# Altium schematic sheet RGMII ETHERNET.SchDoc: RGMII Ethernet
size 431 x 279 mm; CheckedBy: Lance Bantoto; Engineer: Chealsie Bains; DocumentNumber: 17; Revision: 1; SheetNumber: 17; SheetTotal: 23
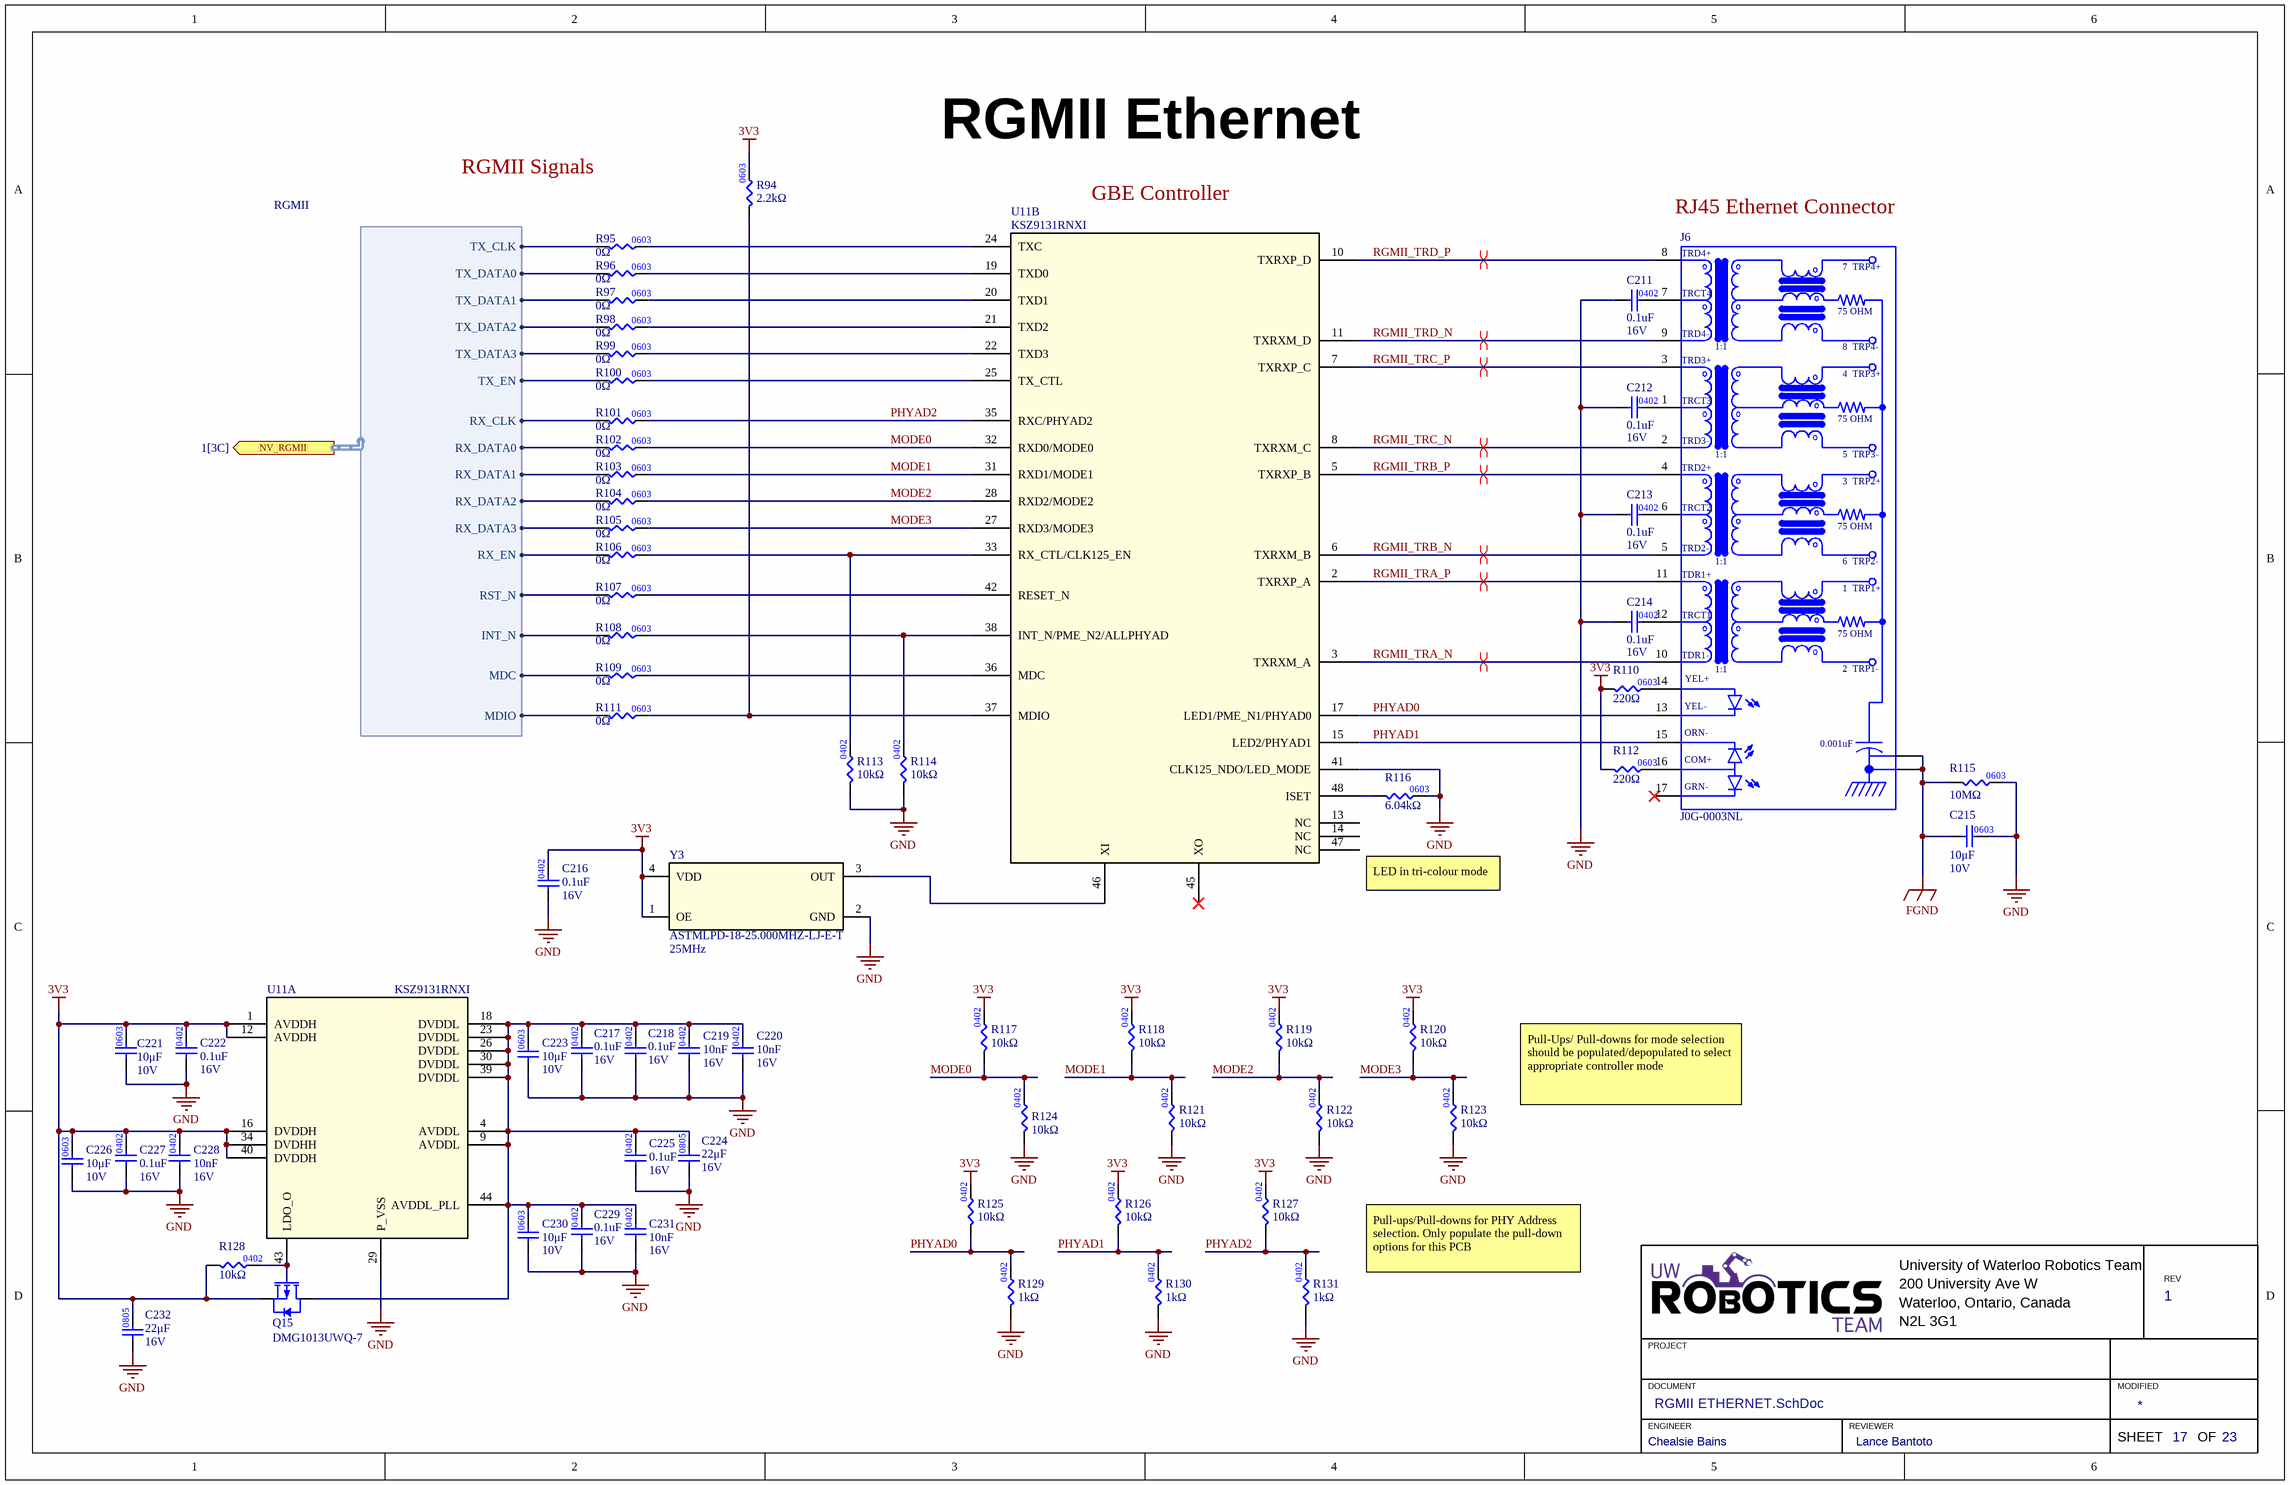
[diagram p0: RGMII ETHERNET.SchDoc]

## Parts
C211  Capacitance: 0.1uF  Rated DC Voltage (URdc): 16V  [CAP0402]  (hidden comment: CAP_0.1uF_16V_X7R_0402)
C212  Capacitance: 0.1uF  Rated DC Voltage (URdc): 16V  [CAP0402]  (hidden comment: CAP_0.1uF_16V_X7R_0402)
C213  Capacitance: 0.1uF  Rated DC Voltage (URdc): 16V  [CAP0402]  (hidden comment: CAP_0.1uF_16V_X7R_0402)
C214  Capacitance: 0.1uF  Rated DC Voltage (URdc): 16V  [CAP0402]  (hidden comment: CAP_0.1uF_16V_X7R_0402)
C215  value 10μF  Voltage Rating: 10V  [CAP0603]  (hidden comment: CAP_10uF_10V_0603)
C216  Capacitance: 0.1uF  Rated DC Voltage (URdc): 16V  [CAP0402]  (hidden comment: CAP_0.1uF_16V_X7R_0402)
C217  Capacitance: 0.1uF  Rated DC Voltage (URdc): 16V  [CAP0402]  (hidden comment: CAP_0.1uF_16V_X7R_0402)
C218  Capacitance: 0.1uF  Rated DC Voltage (URdc): 16V  [CAP0402]  (hidden comment: CAP_0.1uF_16V_X7R_0402)
C219  Capacitance: 10nF  Rated DC Voltage (URdc): 16V  [CAP0402]  (hidden comment: CAP_0.01uF_16V_X7R_0402)
C220  Capacitance: 10nF  Rated DC Voltage (URdc): 16V  [CAP0402]  (hidden comment: CAP_0.01uF_16V_X7R_0402)
C221  value 10μF  Voltage Rating: 10V  [CAP0603]  (hidden comment: CAP_10uF_10V_0603)
C222  Rated DC Voltage (URdc): 16V  Capacitance: 0.1uF  [CAP0402]  (hidden comment: CAP_0.1uF_16V_X7R_0402)
C223  value 10μF  Voltage Rating: 10V  [CAP0603]  (hidden comment: CAP_10uF_10V_0603)
C224  value 22μF  Voltage Rating: 16V  [CAP2012]  (hidden comment: CAP_22uF_16V_0805)
C225  Rated DC Voltage (URdc): 16V  Capacitance: 0.1uF  [CAP0402]  (hidden comment: CAP_0.1uF_16V_X7R_0402)
C226  value 10μF  Voltage Rating: 10V  [CAP0603]  (hidden comment: CAP_10uF_10V_0603)
C227  Rated DC Voltage (URdc): 16V  Capacitance: 0.1uF  [CAP0402]  (hidden comment: CAP_0.1uF_16V_X7R_0402)
C228  Capacitance: 10nF  Rated DC Voltage (URdc): 16V  [CAP0402]  (hidden comment: CAP_0.01uF_16V_X7R_0402)
C229  Capacitance: 0.1uF  Rated DC Voltage (URdc): 16V  [CAP0402]  (hidden comment: CAP_0.1uF_16V_X7R_0402)
C230  value 10μF  Voltage Rating: 10V  [CAP0603]  (hidden comment: CAP_10uF_10V_0603)
C231  Capacitance: 10nF  Rated DC Voltage (URdc): 16V  [CAP0402]  (hidden comment: CAP_0.01uF_16V_X7R_0402)
C232  value 22μF  Voltage Rating: 16V  [CAP2012]  (hidden comment: CAP_22uF_16V_0805)
J6  J0G-0003NL  [PULSE_J0G-0003NL]
Q15  Manufacturer Part Number: DMG1013UWQ-7  (hidden comment: PMOS_20V_820MA SOT323)
R94  value 2.2kΩ  [RES0603]  (hidden comment: RES_2.2kΩ_0603_1%)
R95  value 0Ω  [RES0603]  (hidden comment: RES_0Ω_0603)
R96  value 0Ω  [RES0603]  (hidden comment: RES_0Ω_0603)
R97  value 0Ω  [RES0603]  (hidden comment: RES_0Ω_0603)
R98  value 0Ω  [RES0603]  (hidden comment: RES_0Ω_0603)
R99  value 0Ω  [RES0603]  (hidden comment: RES_0Ω_0603)
R100  value 0Ω  [RES0603]  (hidden comment: RES_0Ω_0603)
R101  value 0Ω  [RES0603]  (hidden comment: RES_0Ω_0603)
R102  value 0Ω  [RES0603]  (hidden comment: RES_0Ω_0603)
R103  value 0Ω  [RES0603]  (hidden comment: RES_0Ω_0603)
R104  value 0Ω  [RES0603]  (hidden comment: RES_0Ω_0603)
R105  value 0Ω  [RES0603]  (hidden comment: RES_0Ω_0603)
R106  value 0Ω  [RES0603]  (hidden comment: RES_0Ω_0603)
R107  value 0Ω  [RES0603]  (hidden comment: RES_0Ω_0603)
R108  value 0Ω  [RES0603]  (hidden comment: RES_0Ω_0603)
R109  value 0Ω  [RES0603]  (hidden comment: RES_0Ω_0603)
R110  value 220Ω  [RES0603]  (hidden comment: RES_220Ω_0603)
R111  value 0Ω  [RES0603]  (hidden comment: RES_0Ω_0603)
R112  value 220Ω  [RES0603]  (hidden comment: RES_220Ω_0603)
R113  Resistance: 10kΩ  [RES0402]  (hidden comment: RES_10kΩ_0402_1%)
R114  Resistance: 10kΩ  [RES0402]  (hidden comment: RES_10kΩ_0402_1%)
R115  value 10MΩ  [RES0603]  (hidden comment: RES_10MΩ_0603)
R116  value 6.04kΩ  [RES0603]  (hidden comment: RES_6.04kΩ_0603_1%)
R117  Resistance: 10kΩ  [RES0402]  (hidden comment: RES_10kΩ_0402_1%)
R118  Resistance: 10kΩ  [RES0402]  (hidden comment: RES_10kΩ_0402_1%)
R119  Resistance: 10kΩ  [RES0402]  (hidden comment: RES_10kΩ_0402_1%)
R120  Resistance: 10kΩ  [RES0402]  (hidden comment: RES_10kΩ_0402_1%)
R121  Resistance: 10kΩ  [RES0402]  (hidden comment: RES_10kΩ_0402_1%)
R122  Resistance: 10kΩ  [RES0402]  (hidden comment: RES_10kΩ_0402_1%)
R123  Resistance: 10kΩ  [RES0402]  (hidden comment: RES_10kΩ_0402_1%)
R124  Resistance: 10kΩ  [RES0402]  (hidden comment: RES_10kΩ_0402_1%)
R125  Resistance: 10kΩ  [RES0402]  (hidden comment: RES_10kΩ_0402_1%)
R126  Resistance: 10kΩ  [RES0402]  (hidden comment: RES_10kΩ_0402_1%)
R127  Resistance: 10kΩ  [RES0402]  (hidden comment: RES_10kΩ_0402_1%)
R128  Resistance: 10kΩ  [RES0805]  (hidden comment: RES_10kΩ_0402)
R129  value 1kΩ  [RES0402]  (hidden comment: RES_1kΩ_0402_1%)
R130  value 1kΩ  [RES0402]  (hidden comment: RES_1kΩ_0402_1%)
R131  value 1kΩ  [RES0402]  (hidden comment: RES_1kΩ_0402_1%)
U11  KSZ9131RNXI  [KSZ9131RNXI]  (parts A,B of 2)
Y3  ASTMLPD-18-25.000MHZ-LJ-E-T  value 25MHz  [ASTMLPE_ABR]

## Ports
NV_RGMII (out, harness RGMII, see 1[3C])

## Harnesses
RGMII: TX_CLK, TX_DATA0, TX_DATA1, TX_DATA3, TX_DATA2, TX_EN, RX_CLK, RX_DATA0, RX_DATA1, RX_DATA2, RX_DATA3, RX_EN, RST_N, INT_N, MDC, MDIO

## Nets
3V3: C216.2 C221.2 C222.2 C226.2 C227.2 C228.2 C232.2 Q15.3(Source) R94.2 R110.1 R112.1 R117.2 R118.2 R119.2 R120.2 R125.2 R126.2 R127.2 R128.1 U11.1(AVDDH) U11.12(AVDDH) U11.16(DVDDH) U11.34(DVDHH) U11.40(DVDDH) Y3.1(OE) Y3.4(VDD)
FGND: C215.1 J6.SH1(SHIELD) J6.SH2(SHIELD) R115.1
GND: C211.1 C212.1 C213.1 C214.1 C215.2 C216.1 C217.1 C218.1 C219.1 C220.1 C221.1 C222.1 C223.1 C224.1 C225.1 C226.1 C227.1 C228.1 C229.1 C230.1 C231.1 C232.1 R113.1 R114.1 R115.2 R116.2 R121.1 R122.1 R123.1 R124.1 R129.1 R130.1 R131.1 U11.29(P_VSS) U11.41(CLK125_NDO/LED_MODE) Y3.2(GND)
MODE0: R102.2 R117.1 R124.2 U11.32(RXD0/MODE0)
MODE1: R103.2 R118.1 R121.2 U11.31(RXD1/MODE1)
MODE2: R104.2 R119.1 R122.2 U11.28(RXD2/MODE2)
MODE3: R105.2 R120.1 R123.2 U11.27(RXD3/MODE3)
PHYAD0: J6.13(YEL-) R125.1 R129.2 U11.17(LED1/PME_N1/PHYAD0)
PHYAD1: J6.15(ORN-) R126.1 R130.2 U11.15(LED2/PHYAD1)
PHYAD2: R101.2 R127.1 R131.2 U11.35(RXC/PHYAD2)
RGMII_TRA_N: J6.10(TDR1-) U11.3(TXRXM_A)
RGMII_TRA_P: J6.11(TDR1+) U11.2(TXRXP_A)
RGMII_TRB_N: J6.5(TRD2-) U11.6(TXRXM_B)
RGMII_TRB_P: J6.4(TRD2+) U11.5(TXRXP_B)
RGMII_TRC_N: J6.2(TRD3-) U11.8(TXRXM_C)
RGMII_TRC_P: J6.3(TRD3+) U11.7(TXRXP_C)
RGMII_TRD_N: J6.9(TRD4-) U11.11(TXRXM_D)
RGMII_TRD_P: J6.8(TRD4+) U11.10(TXRXP_D)
NetC211_2: C211.2 J6.7(TRCT4)
NetC212_2: C212.2 J6.1(TRCT3)
NetC213_2: C213.2 J6.6(TRCT2)
NetC214_2: C214.2 J6.12(TRCT1)
NetC217_2: C217.2 C218.2 C219.2 C220.2 C223.2 C224.2 C225.2 C229.2 C230.2 C231.2 Q15.1(Drain) U11.4(AVDDL) U11.9(AVDDL) U11.18(DVDDL) U11.23(DVDDL) U11.26(DVDDL) U11.30(DVDDL) U11.39(DVDDL) U11.44(AVDDL_PLL)
NetJ6_14: J6.14(YEL+) R110.2
NetJ6_16: J6.16(COM+) R112.2
NetQ15_2: Q15.2(Gate) R128.2 U11.43(LDO_O)
NetR94_1: R94.1 R111.2 U11.37(MDIO)
NetR95_1: R95.1 ; port NV_RGMII.TX_CLK
NetR95_2: R95.2 U11.24(TXC)
NetR96_1: R96.1 ; port NV_RGMII.TX_DATA0
NetR96_2: R96.2 U11.19(TXD0)
NetR97_1: R97.1 ; port NV_RGMII.TX_DATA1
NetR97_2: R97.2 U11.20(TXD1)
NetR98_1: R98.1 ; port NV_RGMII.TX_DATA2
NetR98_2: R98.2 U11.21(TXD2)
NetR99_1: R99.1 ; port NV_RGMII.TX_DATA3
NetR99_2: R99.2 U11.22(TXD3)
NetR100_1: R100.1 ; port NV_RGMII.TX_EN
NetR100_2: R100.2 U11.25(TX_CTL)
NetR101_1: R101.1 ; port NV_RGMII.RX_CLK
NetR102_1: R102.1 ; port NV_RGMII.RX_DATA0
NetR103_1: R103.1 ; port NV_RGMII.RX_DATA1
NetR104_1: R104.1 ; port NV_RGMII.RX_DATA2
NetR105_1: R105.1 ; port NV_RGMII.RX_DATA3
NetR106_1: R106.1 ; port NV_RGMII.RX_EN
NetR106_2: R106.2 R113.2 U11.33(RX_CTL/CLK125_EN)
NetR107_1: R107.1 ; port NV_RGMII.RST_N
NetR107_2: R107.2 U11.42(RESET_N)
NetR108_1: R108.1 ; port NV_RGMII.INT_N
NetR108_2: R108.2 R114.2 U11.38(INT_N/PME_N2/ALLPHYAD)
NetR109_1: R109.1 ; port NV_RGMII.MDC
NetR109_2: R109.2 U11.36(MDC)
NetR111_1: R111.1 ; port NV_RGMII.MDIO
NetR116_1: R116.1 U11.48(ISET)
NetU11_46: U11.46(XI) Y3.3(OUT)

Not connected (* = marked no-connect by the designer): J6 17(GRN-)*; U11 13(NC) 14(NC) 45(XO)* 47(NC)

## Layout directives
differential pair: RGMII_TRA_N, RGMII_TRA_P, RGMII_TRB_N, RGMII_TRB_P, RGMII_TRC_N, RGMII_TRC_P, RGMII_TRD_N, RGMII_TRD_P

## Notes on the sheet
- RGMII Signals
- (near U11) GBE Controller
- (near J6) RJ45 Ethernet Connector
- LED in tri-colour mode
- Pull-Ups/ Pull-downs for mode selection should be populated/depopulated to select appropriate controller mode
- Pull-ups/Pull-downs for PHY Address selection. Only populate the pull-down options for this PCB
- University of Waterloo Robotics Team
- 200 University Ave W
- REV
- PROJECT
- Waterloo, Ontario, Canada
- N2L 3G1
- DOCUMENT
- ENGINEER
- REVIEWER
- MODIFIED
- SHEET
- OF
- (in symbol CAP_10uF_10V_0603) 0603
- (in symbol J0G-0003NL) 7  TRP4+; 75 OHM; 1:1; 8  TRP4-; 4  TRP3+; 5  TRP3-; 3  TRP2+; 6  TRP2-; 1  TRP1+; 2  TRP1-; 0.001uF
- (in symbol RES_10MΩ_0603_5%) 0603

## Library data of the parts
C211-C214 C216-C218 C222 C225 C227 C229 = CAP_0.1uF_16V_X7R_0402: Ceramic Capacitor, Ceramic; Manufacturer: Taiyo Yuden; Manufacturer Part Number: LMK212AC6106MD-T; Multilayer: Yes; Negative Tolerance: 10%; Temperature Characteristics Code: X7R; Supplier 1: Digi-Key; Supplier Part Number 1: 587-6337-1-ND; RoHS: Yes; Stock 1: 703; Pricing 1: 1=0.29000, 10=0.20100, 50=0.12060, 100=0.10180, 500=0.06966, 1000=0.06163 (USD); ComponentLink1URL: https://datasheet.ciiva.com:443/pdfs/VipMasterIC/IC/TAIY/TAIY-S-A0009099504/TAIY-S-A0009099407-1.pdf?src-supplier=IHS+Markit; ComponentLink1Description: https://datasheet.ciiva.com:443/pdfs/VipMasterIC/IC/TAIY/TAIY-S-A0009099504/TAIY-S-A0009099407-1.pdf?src-supplier=IHS+Markit; ComponentLink2URL: https://ds.yuden.co.jp/TYCOMPAS/ut/detail?pn=LMK212AC6106MD-T &amp;u=M&src-supplier=Digi-Key; ComponentLink2Description: https://ds.yuden.co.jp/TYCOMPAS/ut/detail?pn=LMK212AC6106MD-T &amp;u=M&src-supplier=Digi-Key; Supplier 2: Digi-Key; Supplier Part Number 2: 1292-1630-1-ND; Category: Ceramic Capacitors; Stock 2: 20327886; Pricing 2: 1=0.10000, 10=0.02800, 50=0.01500, 100=0.01220, 500=0.00876, 1000=0.00688, 2500=0.00625, 5000=0.00575 (USD); Mount: Surface Mount; Number of Pins: 2; Dielectric Material: Ceramic; Package Shape: Rectangular; Terminal Finish: Nickel; Min Operating Temperature: -55°C; Max Operating Temperature: 125°C; JESD-609 Code: e3; Capacitor Type: Ceramic; Package Style: SMTMeter; Packaging: Tape and Reel; Positive Tolerance: 10%; Termination: Wraparound; Length: 1mm; Width: 0.5mm; Height: 0.5mm; REACH SVHC: Yes; RoHS Compliant: Yes; ComponentLink3URL: https://datasheet.ciiva.com:443/pdfs/VipMasterIC/IC/WATC/WATC-S-A0009550342/WATC-S-A0009550342-1.pdf?src-supplier=IHS+Markit; ComponentLink3Description: https://datasheet.ciiva.com:443/pdfs/VipMasterIC/IC/WATC/WATC-S-A0009550342/WATC-S-A0009550342-1.pdf?src-supplier=IHS+Markit; ComponentLink4URL: http://www.farnell.com/datasheets/2340522.pdf?src-supplier=Farnell; ComponentLink4Description: http://www.farnell.com/datasheets/2340522.pdf?src-supplier=Farnell; ComponentLink5URL: http://components.arrow.com/part/dataview/0323_00654690?src-supplier=Arrow+Europe; ComponentLink5Description: http://components.arrow.com/part/dataview/0323_00654690?src-supplier=Arrow+Europe; ComponentLink6URL: https://www.verical.com/server-webapp/html/getDatasheet?partID=415228&src-supplier=Verical; ComponentLink6Description: https://www.verical.com/server-webapp/html/getDatasheet?partID=415228&src-supplier=Verical; ComponentLink7URL: http://www.passivecomponent.com/indexsea/0402B104K160CT-IN.pdf?src-supplier=Digi-Key; ComponentLink7Description: http://www.passivecomponent.com/indexsea/0402B104K160CT-IN.pdf?src-supplier=Digi-Key; ComponentLink8URL: http://www.passivecomponent.com/wp-content/uploads/2018/10/MLCC.pdf?src-supplier=Digi-Key; ComponentLink8Description: http://www.passivecomponent.com/wp-content/uploads/2018/10/MLCC.pdf?src-supplier=Digi-Key; ComponentLink9URL: http://www.farnell.com/datasheets/2340522.pdf?src-supplier=Element14; ComponentLink9Description: http://www.farnell.com/datasheets/2340522.pdf?src-supplier=Element14; ComponentLink10URL: http://www.farnell.com/datasheets/2340522.pdf?src-supplier=Newark; ComponentLink10Description: http://www.farnell.com/datasheets/2340522.pdf?src-supplier=Newark; Size Code: 0402; Supplier 3: Digi-Key; Supplier Part Number 3: 445-173645-1-ND; Stock 3: 3627; Pricing 3: 1=0.20000, 10=0.14200, 50=0.08080, 100=0.06700, 500=0.04696, 1000=0.03888, 2500=0.03619, 5000=0.03311 (USD); ComponentLink11URL: https://datasheet.ciiva.com:443/pdfs/VipMasterIC/IC/TDKC/TDKC-S-A0007785269/TDKC-S-A0007785269-1.pdf?src-supplier=IHS+Markit; ComponentLink11Description: https://datasheet.ciiva.com:443/pdfs/VipMasterIC/IC/TDKC/TDKC-S-A0007785269/TDKC-S-A0007785269-1.pdf?src-supplier=IHS+Markit; ComponentLink12URL: https://product.tdk.com/info/en/catalog/spec/mlccspec_commercial_soft_en.pdf?src-supplier=Digi-Key; ComponentLink12Description: https://product.tdk.com/info/en/catalog/spec/mlccspec_commercial_soft_en.pdf?src-supplier=Digi-Key
C215 C221 C223 C226 C230 = CAP_10uF_10V_0603: CAP CER 10UF 10V X5R 0603; Manufacturer Part Number 1: CC0603MRX5R6BB106; Manufacturer 1: Yageo; Supplier Part Number 1: 311-1817-1-ND; Supplier 1: Digi-Key; Dielectric: X5R
C219 C220 C228 C231 = CAP_0.01uF_16V_X7R_0402: Ceramic Capacitor, Multilayer, Ceramic, 16V, 5% +Tol, 5% -Tol, X7R, 15% TC, 0.01uF, Surface Mount, 0402; Manufacturer: KEMET; Manufacturer Part Number: C0402C103J4RACTU; Multilayer: Yes; Supplier 1: Digi-Key; Supplier Part Number 1: 399-1039-1-ND; RoHS: Yes; Category: Ceramic Capacitors; Stock 1: 29300; Pricing 1: 1=0.10000, 10=0.04000, 50=0.02200, 100=0.01800, 500=0.01288, 1000=0.01012, 2500=0.00920, 5000=0.00846 (USD); Mount: Surface Mount; Number of Pins: 2; Dielectric Material: Ceramic; Package Shape: Rectangular; Terminal Finish: Nickel; Min Operating Temperature: -55°C; Max Operating Temperature: 125°C; JESD-609 Code: e3; Capacitor Type: Ceramic; Negative Tolerance: 5%; Package Style: SMTMeter; Packaging: Tape and Reel; Positive Tolerance: 5%; Temperature Characteristics Code: X7R; Termination: Wraparound; Length: 1mm; Width: 0.5mm; Height: 0.5mm; REACH SVHC: Yes; RoHS Compliant: Yes; ComponentLink1URL: https://datasheet.ciiva.com:443/pdfs/VipMasterIC/IC/KEME/KEME-S-A0008991654/KEME-S-A0008991654-1.pdf?src-supplier=IHS+Markit; ComponentLink1Description: https://datasheet.ciiva.com:443/pdfs/VipMasterIC/IC/KEME/KEME-S-A0008991654/KEME-S-A0008991654-1.pdf?src-supplier=IHS+Markit; ComponentLink2URL: https://datasheet.ciiva.com/14593/70095383-14593069.pdf?src-supplier=Allied+Electronics; ComponentLink2Description: https://datasheet.ciiva.com/14593/70095383-14593069.pdf?src-supplier=Allied+Electronics; ComponentLink3URL: https://datasheet.ciiva.com/14604/70095383-14604557.pdf?src-supplier=Allied+Electronics; ComponentLink3Description: https://datasheet.ciiva.com/14604/70095383-14604557.pdf?src-supplier=Allied+Electronics; ComponentLink4URL: https://datasheet.ciiva.com/7747/kem-c1002-x7r-smd-7747611.pdf?src-supplier=Element14; ComponentLink4Description: https://datasheet.ciiva.com/7747/kem-c1002-x7r-smd-7747611.pdf?src-supplier=Element14; ComponentLink5URL: https://datasheet.ciiva.com/46448/1851736-46448647.pdf?src-supplier=Element14; ComponentLink5Description: https://datasheet.ciiva.com/46448/1851736-46448647.pdf?src-supplier=Element14; ComponentLink6URL: https://datasheet.ciiva.com/28645/1851736-28645374.pdf?src-supplier=Element14; ComponentLink6Description: https://datasheet.ciiva.com/28645/1851736-28645374.pdf?src-supplier=Element14; Size Code: 0402
C224 C232 = CAP_22uF_16V_0805: CAP CER 22UF 16V X5R 0805; Manufacturer 1: Murata Electronics; Manufacturer Part Number 1: GRM219R61C226ME15L; Package/Footprint: 0805; Mounting Type: SMD; Supplier 1: Digi-Key; Supplier Part Number 1: 490-9952-1-ND; Dielectric: X5R
J6 = J0G-0003NL: 1 Port RJ45 Magjack Connector Through Hole 10/100/1000 Base-T, AutoMDIX; MF: Pulse Electronics; Digi-Key_Part_Number: 553-1852-ND; Package: Custom Package Pulse Electronics Network; MP: J0G-0003NL; SnapEDA_Link: https://www.snapeda.com/parts/J0G-0003NL/Pulse%20Electronics%20Network/view-part/368728/?ref=snap; Digi-Key_Purchase_URL: https://www.digikey.com/product-detail/en/pulse-electronics-network/J0G-0003NL/553-1852-ND/2264761?utm_source=snapeda&utm_medium=aggregator&utm_campaign=symbol; Value: *
Q15 = PMOS_20V_820MA SOT323: Small Signal Field-Effect Transistor, 0.82A I(D), 20V, 1-Element, P-Channel, Silicon, Metal-oxide Semiconductor FET; Manufacturer: Diodes; Supplier 1: Digi-Key; Supplier Part Number 1: DMG1013UWQ-7DICT-ND; RoHS: Yes; Category: MOSFETs; Stock 1: 30274; Pricing 1: 1=0.37000, 10=0.27300, 25=0.23880, 100=0.15450, 500=0.10230, 1000=0.07843 (USD); ComponentLink1URL: https://datasheet.ciiva.com:443/pdfs/VipMasterIC/IC/DIOD/DIOD-S-A0002497929/DIOD-S-A0002497929-1.pdf?src-supplier=IHS+Markit; ComponentLink1Description: https://datasheet.ciiva.com:443/pdfs/VipMasterIC/IC/DIOD/DIOD-S-A0002497929/DIOD-S-A0002497929-1.pdf?src-supplier=IHS+Markit; ComponentLink2URL: http://www.farnell.com/datasheets/2814383.pdf?src-supplier=Farnell; ComponentLink2Description: http://www.farnell.com/datasheets/2814383.pdf?src-supplier=Farnell; ComponentLink3URL: http://www.mouser.com/ds/2/115/DMG1013UWQ-892513.pdf?src-supplier=Mouser; ComponentLink3Description: http://www.mouser.com/ds/2/115/DMG1013UWQ-892513.pdf?src-supplier=Mouser; ComponentLink4URL: https://www.diodes.com/assets/Datasheets/DMG1013UWQ.pdf?src-supplier=Digi-Key; ComponentLink4Description: https://www.diodes.com/assets/Datasheets/DMG1013UWQ.pdf?src-supplier=Digi-Key; ComponentLink5URL: http://www.farnell.com/datasheets/2814383.pdf?src-supplier=Element14; ComponentLink5Description: http://www.farnell.com/datasheets/2814383.pdf?src-supplier=Element14; ComponentLink6URL: http://www.farnell.com/datasheets/2814383.pdf?src-supplier=Newark; ComponentLink6Description: http://www.farnell.com/datasheets/2814383.pdf?src-supplier=Newark
R94 = RES_2.2kΩ_0603_1%: RES 2.2K OHM 1% 1/10W 0603; Manufacturer 1: Yageo; Manufacturer Part Number 1: RC0603FR-072K2L; Supplier Part Number 1: 311-2.20KHRCT-ND; Supplier 1: Digi-Key; Mounting Type: SMD; Package: 0603
R95-R109 R111 = RES_0Ω_0603: RES 0 OHM JUMPER 1/10W 0603; Manufacturer 1: Yageo; Manufacturer Part Number 1: RC0603JR-070RL; Package/Footprint: 0603; Supplier Part Number 1: 311-0.0GRCT-ND; Supplier 1: Digi-Key; Mounting Type: SMD
R110 R112 = RES_220Ω_0603_5%: RES 220 OHM 5% 1/10W 0603; Manufacturer 1: Yageo; Manufacturer Part Number 1: AC0603JR-07220RL; Package/Footprint: 0603; Supplier Part Number 1: YAG3652CT-ND; Supplier 1: Digi-Key
R113 R114 R117-R127 = RES_10kΩ_0402_1%: RES 10K OHM 1% 1/16W 0402; Manufacturer 1: Samsung Electro-Mechanics; Manufacturer Part Number 1: RC1005F103CS; Supplier 1: Digi-Key; Supplier Part Number 1: 1276-3431-1-ND; Tolerance: 1%; Package: 0402
R115 = RES_10MΩ_0603_5%: RES 10M OHM 5% 1/10W 0603; Manufacturer 1: Vishay Dale; Manufacturer Part Number 1: CRCW060310M0JNEA; Supplier Part Number 1: 541-10MGCT-ND; Supplier 1: Digi-Key
R116 = RES_6.04kΩ_0603_1%: RES 6.04K OHM 1% 1/10W 0603; Manufacturer 1: Panasonic Electronic Components; Manufacturer Part Number 1: ERJ-PB3D6041V; Package/Footprint: 0603; Supplier 1: Digi-Key; Supplier Part Number 1: P20372CT-ND; Mounting Type: SMD
R128 = RES_10kΩ_0402: Fixed Resistor, Thin Film, 0.1W, 10000ohm, 50V, 0.1% +/-Tol, 25ppm/Cel, Surface Mount, 0402; Manufacturer 1: Panasonic; Manufacturer Part Number 1: ERJ-PB6B6043V; Manufacturer: Stackpole Electronics; Manufacturer Part Number: RNCF0402BTE10K0; Additional Feature: PRECISION; Rated Power Dissipation (P): 63mW; Rated Temperature: 70°C; Temperature Coefficient: 25ppm/°C; Working Voltage: 25V; Package Height: 0.3mm; Package Length: 1mm; Package Width: 0.5mm; Reference Standard: AEC-Q200; Supplier 1: Digi-Key; Supplier Part Number 1: P20911CT-ND; Supplier 2: Digi-Key; Supplier Part Number 2: RNCF0402BTE10K0CT-ND; RoHS: Yes; Category: Chip SMD Resistors; Stock 2: 76384; Pricing 2: 1=0.36000, 10=0.25900, 100=0.10350, 1000=0.05100, 2500=0.04725, 5000=0.04275 (USD); Mount: Surface Mount; Number of Pins: 2; Package Shape: Rectangular; Terminal Finish: Nickel; Min Operating Temperature: -55°C; Max Operating Temperature: 155°C; Tolerance: 0.1%; JESD-609 Code: e3; Resistor Type: FIXED RESISTOR; Construction: Rectangular; Package Style: SMTMeter; Packaging: Tape and Reel; Technology: THIN FILM; Termination: Wraparound; REACH SVHC: Yes; RoHS Compliant: Yes; ComponentLink1URL: https://datasheet.ciiva.com:443/pdfs/VipMasterIC/IC/SEIE/SEIE-S-A0009648208/SEIE-S-A0009648208-1.pdf?src-supplier=IHS+Markit; ComponentLink1Description: https://datasheet.ciiva.com:443/pdfs/VipMasterIC/IC/SEIE/SEIE-S-A0009648208/SEIE-S-A0009648208-1.pdf?src-supplier=IHS+Markit; ComponentLink2URL: https://www.seielect.com/catalog/SEI-Packaging.pdf?src-supplier=Digi-Key; ComponentLink2Description: https://www.seielect.com/catalog/SEI-Packaging.pdf?src-supplier=Digi-Key; ComponentLink3URL: https://www.seielect.com/Catalog/SEI-rncf.pdf?src-supplier=Avnet; ComponentLink3Description: https://www.seielect.com/Catalog/SEI-rncf.pdf?src-supplier=Avnet; Size Code: 0402
R129-R131 = RES_1kΩ_0402_1%: RES 1K OHM 1% 1/16W 0402; Manufacturer 1: Stackpole Electronics; Manufacturer Part Number 1: RMCF0402FT1K00; Supplier 1: Digi-Key; Supplier Part Number 1: RMCF0402FT1K00CT-ND; Tolerance: 1%; Package: 0402
U11 = KSZ9131RNXI: Ethernet Transceiver, PQCC48; Manufacturer: Microchip Technologies; Manufacturer Product Number: KSZ9131RNXI
Y3 = ASTMLPD-18-25.000MHZ-LJ-E-T: MEMS OSC XO 25.0000MHZ LVCMOS; Manufacturer 1: Abracon; Manufacturer Part Number 1: ASTMLPD-18-25.000MHZ-LJ-E-T; Supplier 1: Digi-Key; Supplier Part Number 1: 535-13096-1-ND